# Altium schematic sheet Flash&TF.SchDoc
size A4
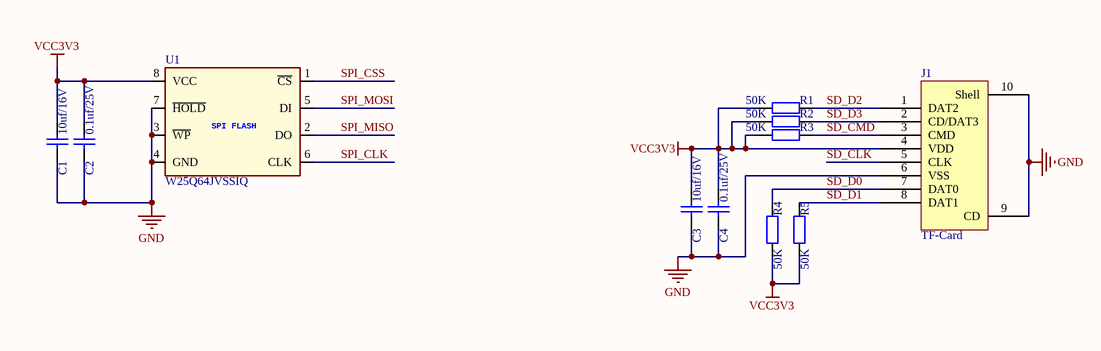
[diagram p0: Flash&TF.SchDoc]

## Parts
C1  10uf/16V  [C_0603]
C2  0.1uf/25V  [C_0603]
C3  10uf/16V  [C_0603]
C4  0.1uf/25V  [C_0603]
J1  TF-Card  [DM3CS-TFCardSlot]
R1  50K  [R_0603]
R2  50K  [R_0603]
R3  50K  [R_0603]
R4  50K  [R_0603]
R5  50K  [R_0603]
U1  W25Q64JVSSIQ  [SOP8]

## Nets
GND: C1.1 C2.1 C3.1 C4.1 J1.6(VSS) J1.9(CD) J1.10(Shell) U1.3(~{WP}) U1.4(GND) U1.7(~{HOLD})
VCC3V3: C1.2 C2.2 C3.2 C4.2 J1.4(VDD) R1.2 R2.2 R3.2 R4.1 R5.1 U1.8(VCC)
SD_CLK: J1.5(CLK)
SD_CMD: J1.3(CMD) R3.1
SD_D0: J1.7(DAT0) R4.2
SD_D1: J1.8(DAT1) R5.2
SD_D2: J1.1(DAT2) R1.1
SD_D3: J1.2(CD/DAT3) R2.1
SPI_CLK: U1.6(CLK)
SPI_CSS: U1.1(~{CS})
SPI_MISO: U1.2(DO)
SPI_MOSI: U1.5(DI)

## Library data of the parts
C1 C3 = C-0603-10uf/16V-10%: 多层片式陶瓷电容器; 精度: 10%; 物料厂家: muRata; 原厂订货号: GRM188R61C106KAALD; 封装: C_0603; 描述: 多层片式陶瓷电容器; 值: 10uf/16V
C2 C4 = C-0603-0.1uf/25V-10%: 多层片式陶瓷电容器; 精度: 5%; 物料厂家: YAGEO; 原厂订货号: CC0603JRX7R8BB104; 封装: C_0603; 描述: 多层片式陶瓷电容器; 值: 0.1uf/25V
J1 = TF-Card: TF-Card Connector; 物料厂家: HRS; 原厂订货号: DM3CS-SF; 描述: TF-Card Connector; 天远物料编号: *
R1-R5 = R-0603-50K-1%: 通用电阻; 精度: 1%; 物料厂家: Yageo; 描述: 薄膜精密电阻; 原厂订货号: RC0603FR-07150KL; 封装: R_0603; 值: 50K
U1 = W25Q64: SPI FLASH; 物料厂家: WINBOND(华邦); 封装: SOP8 (SOIC-8_150mil ); 描述: SPI FLASH; 原厂订货号: W25Q64JVSSIQ; 值: W25Q64JVSSIQ; 精度: *